# Altium schematic sheet Sheet1.SchDoc
size OrCAD C; SheetNumber: 1; SheetTotal: 1; SPICEModelCacheQUOSSJTI: <root> / <DocumentId>QUOSSJTI</DocumentId> / </root>
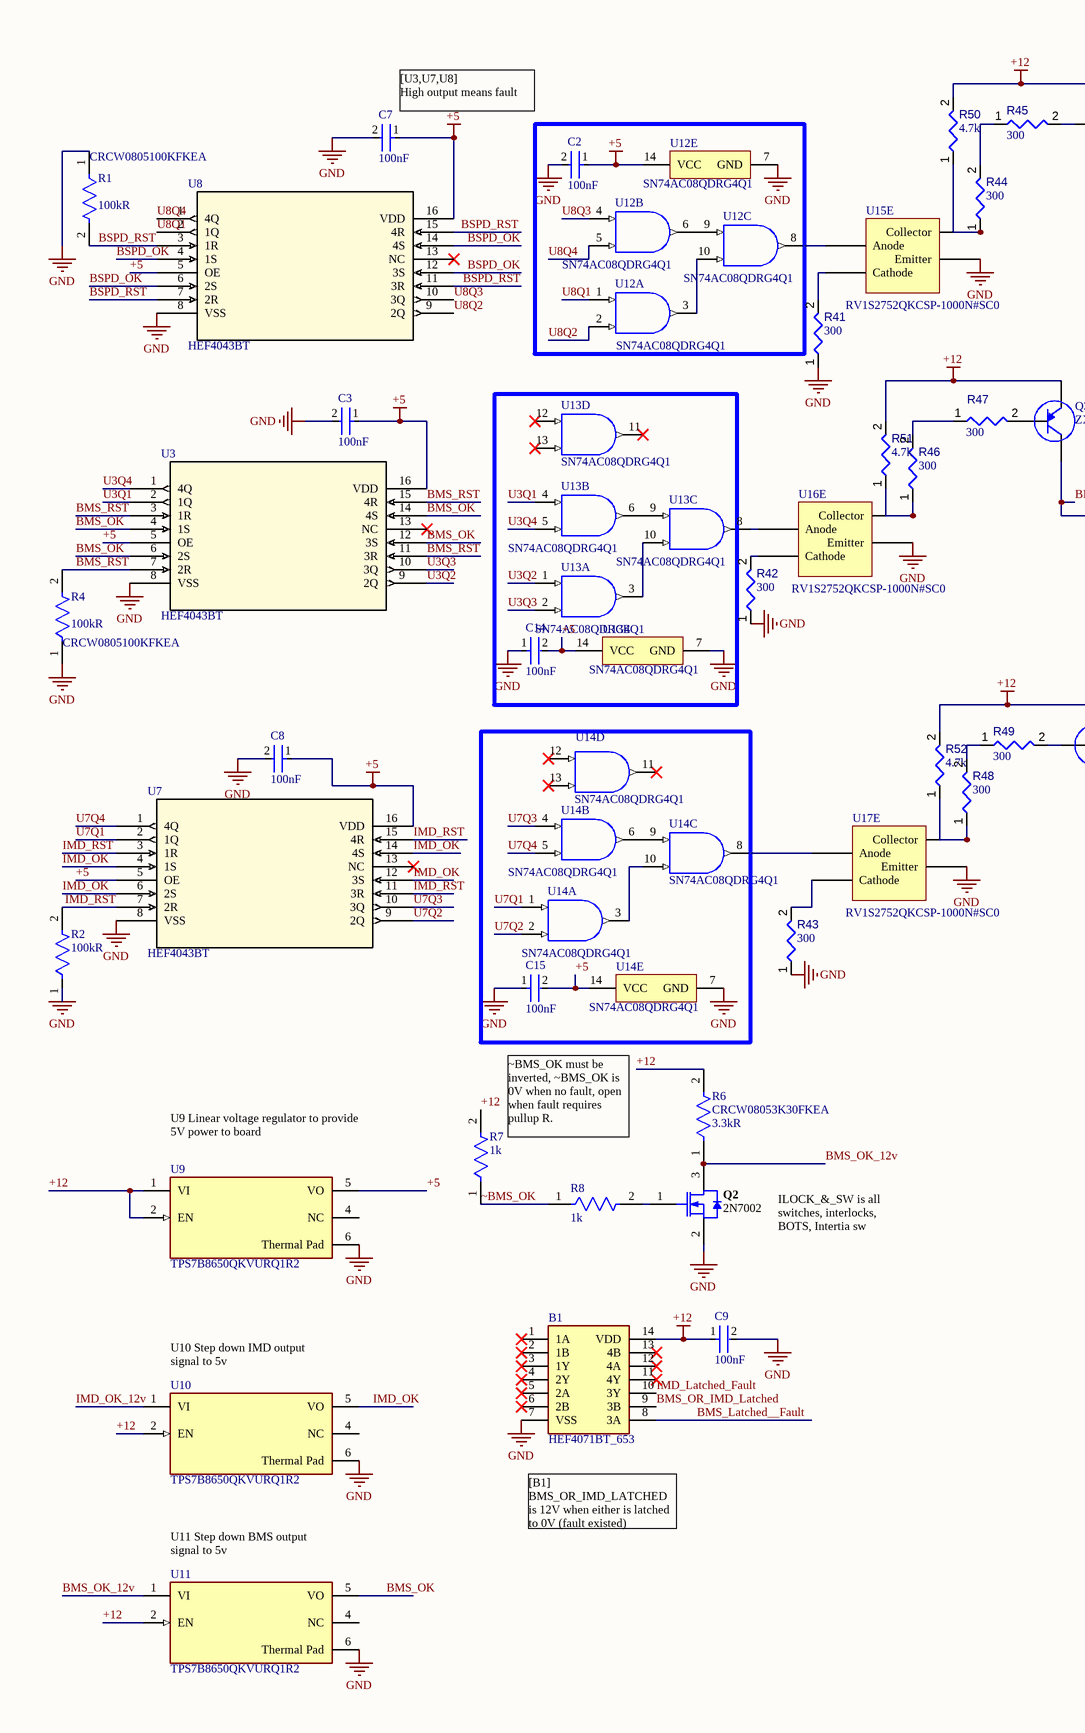
[diagram p0: Sheet1.SchDoc, left]
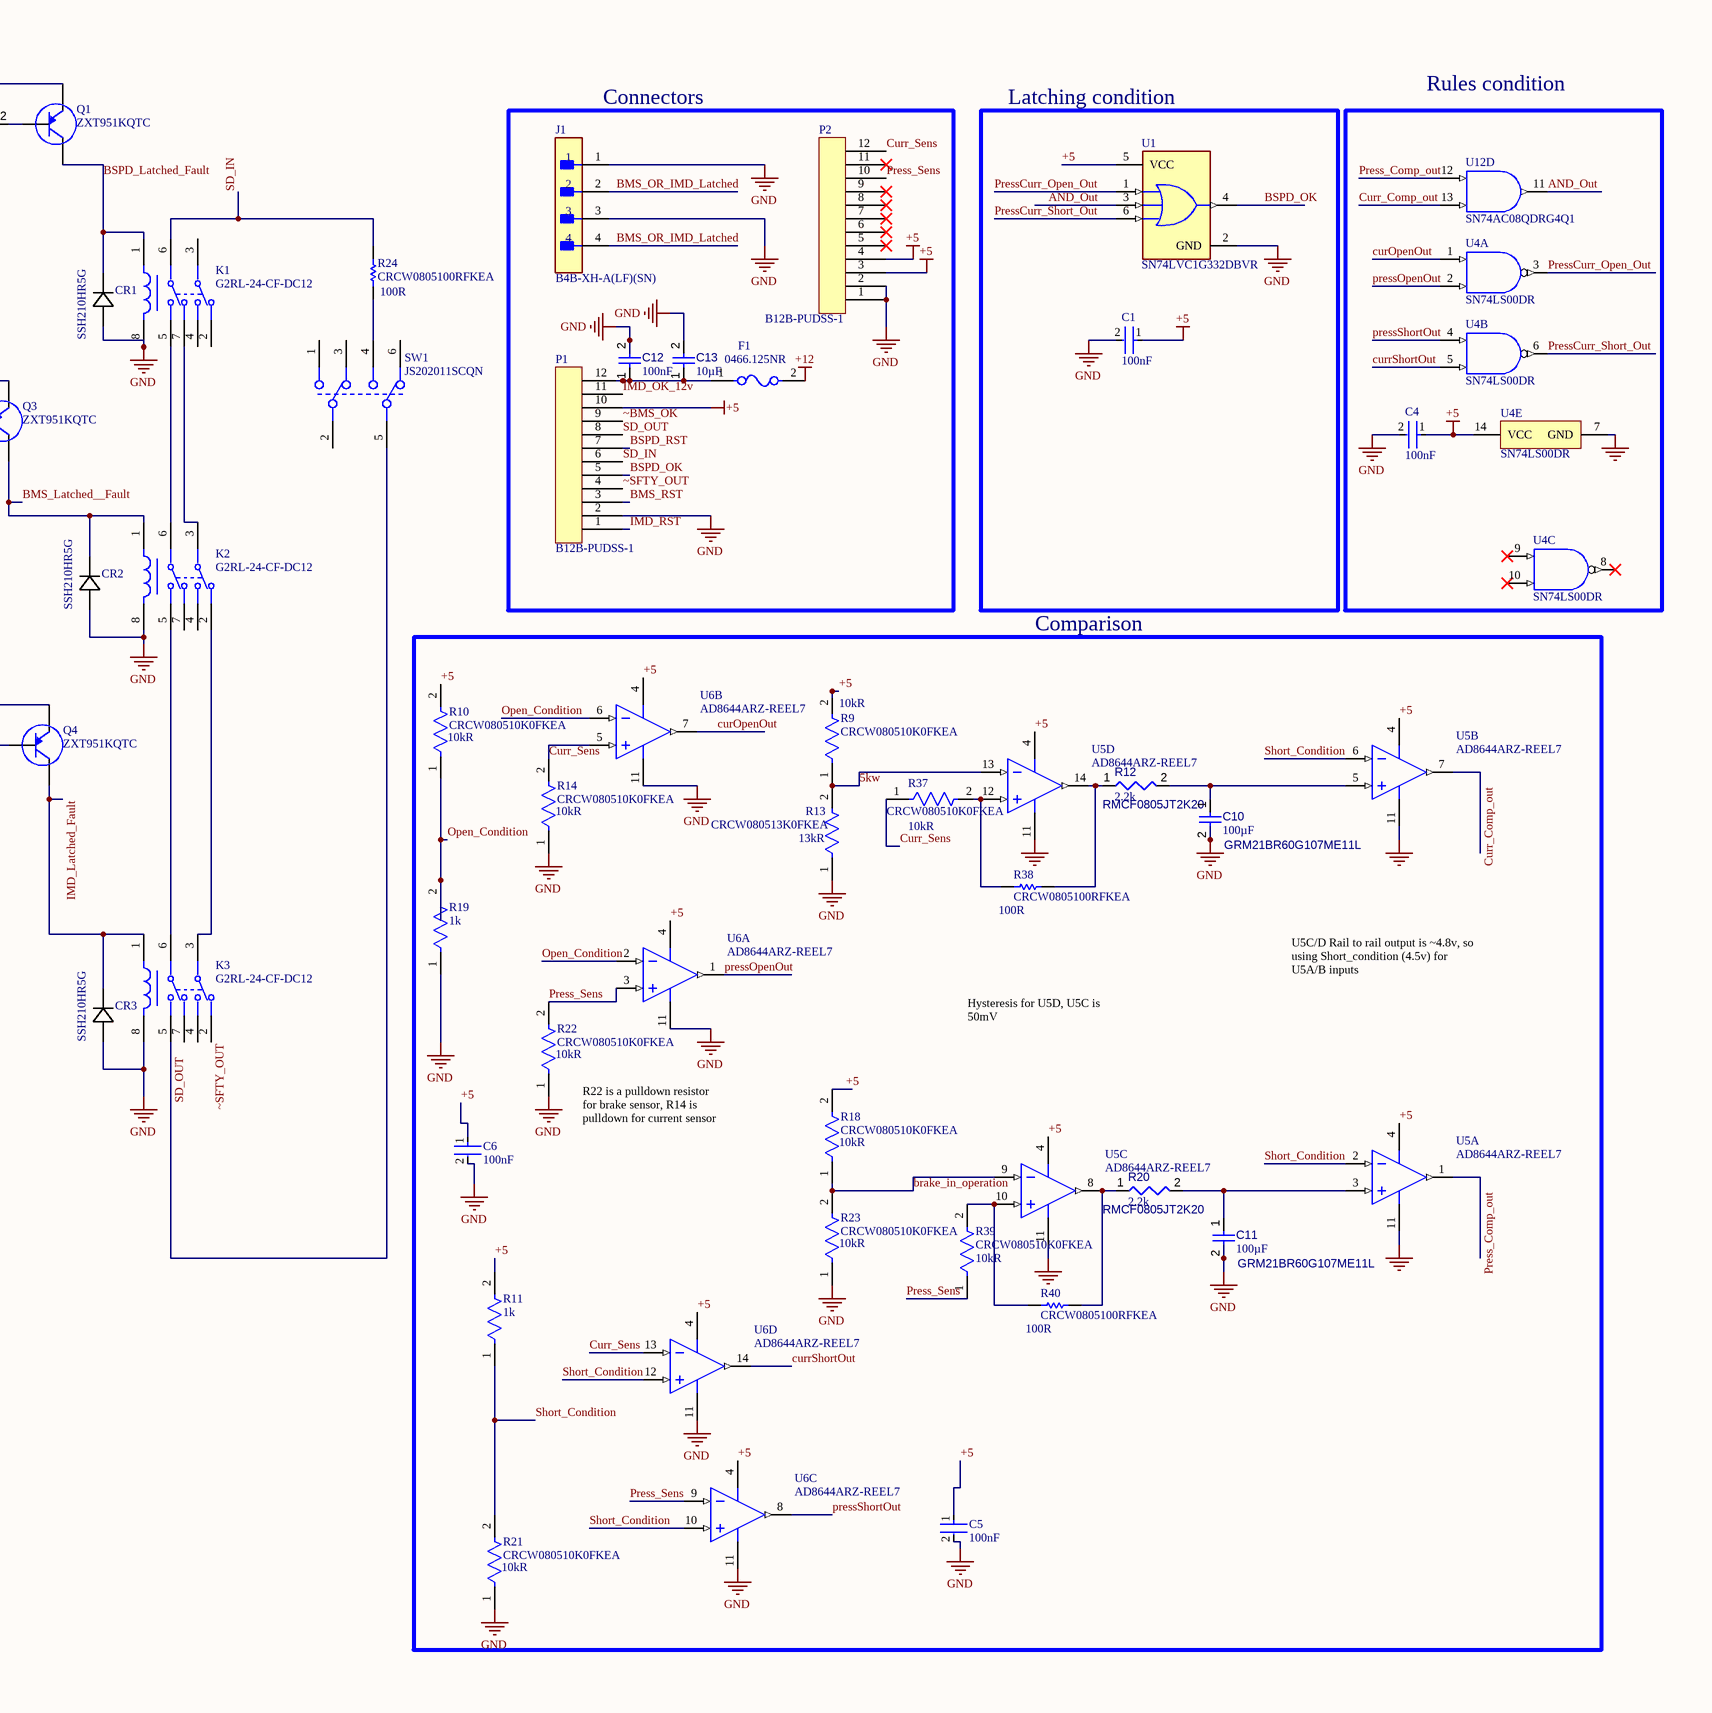
[diagram p1: Sheet1.SchDoc, right]

## Parts
B1  HEF4071BT_653  [SOIC127P600X175-14N]
C1  value 100nF  [FP-GCD21B-0_15-IPC_A]  (hidden comment: GCD21BR71H104KA01L)
C2  value 100nF  [FP-GCD21B-0_15-IPC_A]  (hidden comment: GCD21BR71H104KA01L)
C3  value 100nF  [FP-GCD21B-0_15-IPC_A]  (hidden comment: GCD21BR71H104KA01L)
C4  value 100nF  [FP-GCD21B-0_15-IPC_A]  (hidden comment: GCD21BR71H104KA01L)
C5  value 100nF  [FP-GCD21B-0_15-IPC_A]  (hidden comment: GCD21BR71H104KA01L)
C6  value 100nF  [FP-GCD21B-0_15-IPC_A]  (hidden comment: GCD21BR71H104KA01L)
C7  value 100nF  [FP-GCD21B-0_15-IPC_A]  (hidden comment: GCD21BR71H104KA01L)
C8  value 100nF  [FP-GCD21B-0_15-IPC_A]  (hidden comment: GCD21BR71H104KA01L)
C9  value 100nF  [FP-GCD21B-0_15-IPC_A]  (hidden comment: GCD21BR71H104KA01L)
C10  GRM21BR60G107ME11L  value 100µF  [CAPC0805(2012)145_L]
C11  GRM21BR60G107ME11L  value 100µF  [CAPC0805(2012)145_L]
C12  value 100nF  [CAPC2013X95X50LL10T25]  (hidden comment: Capacitor 100 nF +/-10% 50 V 0805)
C13  value 10µF  [CAPC2013X135X45NL10T25]  (hidden comment: Capacitor 10 uF +/- 10% 16 V 0805)
C14  value 100nF  [FP-GCD21B-0_15-IPC_A]  (hidden comment: GCD21BR71H104KA01L)
C15  value 100nF  [FP-GCD21B-0_15-IPC_A]  (hidden comment: GCD21BR71H104KA01L)
CR1  SSH210HR5G  [CR_DO214AA_TWS]
CR2  SSH210HR5G  [CR_DO214AA_TWS]
CR3  SSH210HR5G  [CR_DO214AA_TWS]
F1  0466.125NR  [FP-0466-MFG]
J1  B4B-XH-A(LF)(SN)  [FP-B4B-XH-A_LF_SN-MFG]
K1  G2RL-24-CF-DC12  [FP-G2RL-24-CF-DC24-MFG]
K2  G2RL-24-CF-DC12  [FP-G2RL-24-CF-DC24-MFG]
K3  G2RL-24-CF-DC12  [FP-G2RL-24-CF-DC24-MFG]
P1  B12B-PUDSS-1  [CONN_B12B-PUDSS_JST]
P2  B12B-PUDSS-1  [CONN_B12B-PUDSS_JST]
Q1  ZXT951KQTC  [DPAK228P990X239-4N]
Q2  2N7002  [INF-PG-SOT23_M]
Q3  ZXT951KQTC  [DPAK228P990X239-4N]
Q4  ZXT951KQTC  [DPAK228P990X239-4N]
R1  CRCW0805100KFKEA  Resistance: 100kR  [FP-CRCW0805-e3-MFG]
R2  Resistance: 100kR  [FP-CRCW0805-e3-MFG]  (hidden comment: CRCW0805100KFKEA)
R4  CRCW0805100KFKEA  Resistance: 100kR  [FP-CRCW0805-e3-MFG]
R6  CRCW08053K30FKEA  Resistance: 3.3kR  [FP-CRCW0805-e3-IPC_B]
R7  value 1k  [FP-CRCW0805-HPe3-IPC_B]  (hidden comment: CRCW08051K00JNEAHP)
R8  value 1k  [FP-CRCW0805-HPe3-IPC_B]  (hidden comment: CRCW08051K00JNEAHP)
R9  CRCW080510K0FKEA  Resistance: 10kR  [FP-CRCW0805-e3-IPC_A]
R10  CRCW080510K0FKEA  Resistance: 10kR  [FP-CRCW0805-e3-IPC_A]
R11  value 1k  [FP-CRCW0805-HPe3-IPC_B]  (hidden comment: CRCW08051K00JNEAHP)
R12  RMCF0805JT2K20  value 2.2k  [FP-RMCF0805-MFG]
R13  CRCW080513K0FKEA  Resistance: 13kR  [FP-CRCW0805-e3-IPC_C]
R14  CRCW080510K0FKEA  Resistance: 10kR  [FP-CRCW0805-e3-IPC_A]
R18  CRCW080510K0FKEA  Resistance: 10kR  [FP-CRCW0805-e3-IPC_A]
R19  value 1k  [FP-CRCW0805-HPe3-IPC_B]  (hidden comment: CRCW08051K00JNEAHP)
R20  RMCF0805JT2K20  value 2.2k  [FP-RMCF0805-MFG]
R21  CRCW080510K0FKEA  Resistance: 10kR  [FP-CRCW0805-e3-IPC_A]
R22  CRCW080510K0FKEA  Resistance: 10kR  [FP-CRCW0805-e3-IPC_A]
R23  CRCW080510K0FKEA  Resistance: 10kR  [FP-CRCW0805-e3-IPC_A]
R24  CRCW0805100RFKEA  resistance: 100R  [RESC2013X50X30LL20T20]
R37  CRCW080510K0FKEA  Resistance: 10kR  [FP-CRCW0805-e3-IPC_A]
R38  CRCW0805100RFKEA  resistance: 100R  [RESC2013X50X30LL20T20]
R39  CRCW080510K0FKEA  Resistance: 10kR  [FP-CRCW0805-e3-IPC_A]
R40  CRCW0805100RFKEA  resistance: 100R  [RESC2013X50X30LL20T20]
R41  value 300  [RESC2012X05N]  (hidden comment: CRCW0805300RJNEA)
R42  value 300  [RESC2012X05N]  (hidden comment: CRCW0805300RJNEA)
R43  value 300  [RESC2012X05N]  (hidden comment: CRCW0805300RJNEA)
R44  value 300  [RESC2012X05N]  (hidden comment: CRCW0805300RJNEA)
R45  value 300  [RESC2012X05N]  (hidden comment: CRCW0805300RJNEA)
R46  value 300  [RESC2012X05N]  (hidden comment: CRCW0805300RJNEA)
R47  value 300  [RESC2012X05N]  (hidden comment: CRCW0805300RJNEA)
R48  value 300  [RESC2012X05N]  (hidden comment: CRCW0805300RJNEA)
R49  value 300  [RESC2012X05N]  (hidden comment: CRCW0805300RJNEA)
R50  value 4.7k  [RESC2012X06N]  (hidden comment: RT0805FRE074K7L)
R51  value 4.7k  [RESC2012X06N]  (hidden comment: RT0805FRE074K7L)
R52  value 4.7k  [RESC2012X06N]  (hidden comment: RT0805FRE074K7L)
SW1  JS202011SCQN  [FP-JS202011SCQN-MFG]
U1  SN74LVC1G332DBVR  [FP-DBV0006A-MFG]
U3  HEF4043BT  [SOT109-1_NEX]
U4  SN74LS00DR  [D0014A_L]  (parts A,B,C,E of 5)
U5  AD8644ARZ-REEL7  [ADI-R-14_M]  (parts A,B,C,D of 4)
U6  AD8644ARZ-REEL7  [ADI-R-14_M]  (parts A,B,C,D of 4)
U7  HEF4043BT  [SOT109-1_NEX]
U8  HEF4043BT  [SOT109-1_NEX]
U9  TPS7B8650QKVURQ1R2  [FP-KVU0005A-MFG]
U10  TPS7B8650QKVURQ1R2  [FP-KVU0005A-MFG]
U11  TPS7B8650QKVURQ1R2  [FP-KVU0005A-MFG]
U12  SN74AC08QDRG4Q1  [D0014A_N]  (parts A,B,C,D,E of 5)
U13  SN74AC08QDRG4Q1  [D0014A_N]  (parts A,B,C,D,E of 5)
U14  SN74AC08QDRG4Q1  [D0014A_N]  (parts A,B,C,D,E of 5)
U15  RV1S2752QKCSP-1000N#SC0  [RV1S2752QKCSP-1000N#SC0]  (part E of 5)
U16  RV1S2752QKCSP-1000N#SC0  [RV1S2752QKCSP-1000N#SC0]  (part E of 5)
U17  RV1S2752QKCSP-1000N#SC0  [RV1S2752QKCSP-1000N#SC0]  (part E of 5)

## Blocks framed on the sheet
Connectors: C12 C13 F1 J1 P1 P2
Latching condition: C1 U1
Rules condition: C4 U4 U12
Comparison: C5 C6 C10 C11 R9-R14 R18-R23 R37-R40 U5 U6

## Nets
+5: C1.1 C2.1 C3.1 C4.1 C5.1 C6.1 C7.1 C8.1 C14.2 C15.2 P1.10 P2.3 P2.4 R9.2 R10.2 R11.2 R18.2 U1.5(VCC) U3.5(OE) U3.16(VDD) U4.14(VCC) U5.4(+V) U6.4(+V) U7.5(OE) U7.16(VDD) U8.5(OE) U8.16(VDD) U9.5(VO) U12.14(VCC) U13.14(VCC) U14.14(VCC)
+12: B1.14(VDD) C9.1 F1.2 Q1.3(E) Q3.3(E) Q4.3(E) R6.2 R7.2 R50.2 R51.2 R52.2 U9.1(VI) U9.2(EN) U10.2(EN) U11.2(EN)
GND: B1.7(VSS) C1.2 C2.2 C3.2 C4.2 C5.2 C6.2 C7.2 C8.2 C9.2 C10.2 C11.2 C12.2 C13.2 C14.1 C15.1 CR1.2 CR2.2 CR3.2 J1.1 J1.3 K1.8 K2.8 K3.8 P1.2 P2.1 P2.2 Q2.2(SOURCE) R1.1 R2.1 R4.1 R13.1 R14.1 R19.1 R21.1 R22.1 R23.1 R41.1 R42.1 R43.1 U1.2(GND) U3.8(VSS) U4.7(GND) U5.11(-V) U6.11(-V) U7.8(VSS) U8.8(VSS) U9.6(Thermal_Pad) U10.6(Thermal_Pad) U11.6(Thermal_Pad) U12.7(GND) U13.7(GND) U14.7(GND) U15.3(Emitter) U16.3(Emitter) U17.3(Emitter)
5kw: R9.1 R13.2 U5.13(-IN_D)
AND_Out: U1.3(B) U12.11(4Y)
BMS_Latched__Fault: B1.8(3A) CR2.1 K2.1 Q3.2(C)
BMS_OK: U3.4(1S) U3.6(2S) U3.12(3S) U3.14(4S) U11.5(VO)
BMS_OK_12v: Q2.3(DRAIN) R6.1 U11.1(VI)
BMS_OR_IMD_Latched: B1.9(3B) J1.2 J1.4
BMS_RST: P1.3 R4.2 U3.3(1R) U3.7(2R) U3.11(3R) U3.15(4R)
brake_in_operation: R18.1 R23.2 U5.9(-IN_C)
BSPD_Latched_Fault: CR1.1 K1.1 Q1.2(C)
BSPD_OK: P1.5 U1.4(Y) U8.4(1S) U8.6(2S) U8.12(3S) U8.14(4S)
BSPD_RST: P1.7 R1.2 U8.3(1R) U8.7(2R) U8.11(3R) U8.15(4R)
curOpenOut: U4.1(1A) U6.7(OUT_B)
Curr_Comp_out: U5.7(OUT_B) U12.13(4B)
Curr_Sens: P2.12 R14.2 R37.1 U6.5(+IN_B) U6.13(-IN_D)
currShortOut: U4.5(2B) U6.14(OUT_D)
IMD_Latched_Fault: B1.10(3Y) CR3.1 K3.1 Q4.2(C)
IMD_OK: U7.4(1S) U7.6(2S) U7.12(3S) U7.14(4S) U10.5(VO)
IMD_OK_12v: P1.11 U10.1(VI)
IMD_RST: P1.1 R2.2 U7.3(1R) U7.7(2R) U7.11(3R) U7.15(4R)
Open_Condition: R10.1 R19.2 U6.2(-IN_A) U6.6(-IN_B)
Press_Comp_out: U5.1(OUT_A) U12.12(4A)
Press_Sens: P2.10 R22.2 R39.1 U6.3(+IN_A) U6.9(-IN_C)
PressCurr_Open_Out: U1.1(A) U4.3(1Y)
PressCurr_Short_Out: U1.6(C) U4.6(2Y)
pressOpenOut: U4.2(1B) U6.1(OUT_A)
pressShortOut: U4.4(2A) U6.8(OUT_C)
SD_IN: K1.6 P1.6 R24.2
SD_OUT: K3.5 P1.8 SW1.5
Short_Condition: R11.1 R21.2 U5.2(-IN_A) U5.6(-IN_B) U6.10(+IN_C) U6.12(+IN_D)
U3Q1: U3.2(1Q) U13.4(2A)
U3Q2: U3.9(2Q) U13.1(1A)
U3Q3: U3.10(3Q) U13.2(1B)
U3Q4: U3.1(4Q) U13.5(2B)
U7Q1: U7.2(1Q) U14.1(1A)
U7Q2: U7.9(2Q) U14.2(1B)
U7Q3: U7.10(3Q) U14.4(2A)
U7Q4: U7.1(4Q) U14.5(2B)
U8Q1: U8.2(1Q) U12.1(1A)
U8Q2: U8.9(2Q) U12.2(1B)
U8Q3: U8.10(3Q) U12.4(2A)
U8Q4: U8.1(4Q) U12.5(2B)
~BMS_OK: P1.9 R7.1 R8.1
~SFTY_OUT: K3.2 P1.4
NetC10_1: C10.1 R12.2 U5.5(+IN_B)
NetC11_1: C11.1 R20.2 U5.3(+IN_A)
NetC12_1: C12.1 C13.1 F1.1 P1.12
NetK1_5: K1.5 K2.6
NetK1_7: K1.7 K2.3
NetK2_2: K2.2 K3.3
NetK2_5: K2.5 K3.6
NetQ1_1: Q1.1(B) R45.2
NetQ2_1: Q2.1(GATE) R8.2
NetQ3_1: Q3.1(B) R47.2
NetQ4_1: Q4.1(B) R49.2
NetR12_1: R12.1 R38.2 U5.14(OUT_D)
NetR20_1: R20.1 R40.2 U5.8(OUT_C)
NetR24_1: R24.1 SW1.4
NetR37_2: R37.2 R38.1 U5.12(+IN_D)
NetR39_2: R39.2 R40.1 U5.10(+IN_C)
NetR41_2: R41.2 U15.2(Cathode)
NetR42_2: R42.2 U16.2(Cathode)
NetR43_2: R43.2 U17.2(Cathode)
NetR44_1: R44.1 R50.1 U15.4(Collector)
NetR44_2: R44.2 R45.1
NetR46_1: R46.1 R51.1 U16.4(Collector)
NetR46_2: R46.2 R47.1
NetR48_1: R48.1 R52.1 U17.4(Collector)
NetR48_2: R48.2 R49.1
NetU12_3: U12.3(1Y) U12.10(3B)
NetU12_6: U12.6(2Y) U12.9(3A)
NetU12_8: U12.8(3Y) U15.1(Anode)
NetU13_3: U13.3(1Y) U13.10(3B)
NetU13_6: U13.6(2Y) U13.9(3A)
NetU13_8: U13.8(3Y) U16.1(Anode)
NetU14_3: U14.3(1Y) U14.10(3B)
NetU14_6: U14.6(2Y) U14.9(3A)
NetU14_8: U14.8(3Y) U17.1(Anode)

Not connected (* = marked no-connect by the designer): B1 1(1A)* 2(1B)* 3(1Y)* 4(2Y)* 5(2A)* 6(2B)* 11(4Y)* 12(4A)* 13(4B)*; K1 2 3 4; K2 4 7; K3 4 7; P2 5* 6* 7* 8* 9* 11*; SW1 1 2 3 6; U3 13(NC)*; U4 8(3Y)* 9(3A)* 10(3B)*; U7 13(NC)*; U8 13(NC)*; U9 4(NC); U10 4(NC); U11 4(NC); U13 11(4Y)* 12(4A)* 13(4B)*; U14 11(4Y)* 12(4A)* 13(4B)*

## Notes on the sheet
- (near C7) [U3,U7,U8]
  High output means fault
- Hysteresis for U5D, U5C is 50mV
- U5C/D Rail to rail output is ~4.8v, so using Short_condition (4.5v) for U5A/B inputs
- (near R7) ~BMS_OK must be inverted, ~BMS_OK is 0V when no fault, open when fault requires pullup R.
- (near R22) R22 is a pulldown resistor for brake sensor, R14 is pulldown for current sensor
- (near U9) U9 Linear voltage regulator to provide 5V power to board
- ILOCK_&_SW is all switches, interlocks, BOTS, Intertia sw
- (near U10) U10 Step down IMD output signal to 5v
- [B1] BMS_OR_IMD_LATCHED is 12V when either is latched to 0V (fault existed)
- (near U11) U11 Step down BMS output signal to 5v

## Library data of the parts
B1 = CMP-134-000000-1: HEF4071B - Quad 2-input OR gate@en-us; Manufacturer_Part_Number: HEF4071BT,653; Manufacturer_Name: Nexperia; Geometry.Height: 1.75mm; Mouser Part Number: 771-HEF4071BTD-T; Datasheet Link: https://assets.nexperia.com/documents/data-sheet/HEF4071B.pdf; Mouser Price/Stock: https://www.mouser.co.uk/ProductDetail/Nexperia/HEF4071BT653?qs=me8TqzrmIYXNRWvrSyNJIw%3D%3D; Source: HEF4071BT_653.SchLib; Design Item ID: HEF4071BT_653
C1-C9 C14 C15 = CMP-001-00087-1: Ceramic Capacitor, Multilayer, Ceramic, 50V, 10% +Tol, 10% -Tol, X7R, 15% TC, 0.1uF, Surface Mount, 0805; Case/Package: 0805; Mounting Technology: Surface Mount; Min Operating Temperature: -55°C; Capacitor Type: Ceramic; Pins: 2; RoHS Compliant: Yes; Max Operating Temperature: 125°C
C10 C11 = CMP-001-00054-4: Chip Capacitor, 100µF +/-20%, 6.3V, 0805, Thickness 1.45 mm; Tolerance: 10%; Min Operating Temperature: -55°C; Max Operating Temperature: 85°C; Pins: 2; Mounting Technology: SMT; Case/Package: 0805; Voltage Rating: 6.3V
C12 = CMP-001-00018-6: Chip Capacitor, 100 nF, +/- 10%, 50 V, 0805 (2012 Metric); Capacitor Type: Ceramic; Voltage Rating: 50V; Pins: 2; Max Operating Temperature: 125°C; Min Operating Temperature: -55°C; Mounting Technology: SM; Case/Package: 0805; RoHS Compliant: True; Tolerance: 10%
C13 = CMP-001-00015-6: Chip Capacitor, 10 uF, +/- 10%, 16 V, 0805 (2012 Metric); Voltage Rating: 16V; Capacitor Type: Ceramic; RoHS Compliant: True; Max Operating Temperature: 85°C; Min Operating Temperature: -55°C; Mounting Technology: SM; Tolerance: 10%; Case/Package: 0805; Pins: 2
CR1-CR3 = CMP-171-000003-1: No Description Available; Mfr_Name: Taiwan Semiconductor; Design Item ID: SSH210HR5G; Source: SSH210HR5G.SchLib
F1 = CMP-08605-000030-1: FUSE BOARD MNT 125MA 125VAC/VDC; Manufacturer: Littelfuse Inc; Fuse Current: 0.125A; Value: 3.925Ω; Max Fuse Ac Voltage: 125V; Fuse Interrupt Dc Current: 50A; Fuse Voltage Drop: 634.37mV; Fuse I2T: 0.00064A2Sec; Fuse Blow Speed: Fast; Octopart: https://octopart.com/0466.125nr-littelfuse-566000; Temperature: -55°C to +90°C; ComponentLink2URL: https://www.littelfuse.com/~/media/electronics/datasheets/fuses/littelfuse_fuse_466_datasheet.pdf.pdf; Category: Fuse; Temperature Range High: +90°C; Resistance: 3.925Ω; ComponentLink2Description: Datasheet; Package: 0466; Height: 0.66mm; Mouser Description: Surface Mount Fuses 125V .125A VFA Slimline; Automotive: No; RoHS: TRUE; Device Class L2: Fuses; Voltage Rating: 125V; Lead Free: Yes; Manufacturer Part Number: 0466.125NR; Temperature Range Low: -55°C; Device Class L3: unset; Device Class L1: Circuit Protection; Max Fuse Dc Voltage: 125V; Fuse Interrupt Ac Current: 50A; Digikey Description: FUSE BOARD MNT 125MA 125VAC/VDC
J1 = CMP-17439-000250-1: CONN HEADER VERT 4POS 2.5MM; Number of Contacts: 4; Contact Resistance: 20mR; Voltage Rating: 250V; Max Current Rating: 3A; Gender: Male; Wire/Cable Gauge: 22AWG; Mated Stacking Heights: 9.8mm; Insulation Resistance: 1GR; Orientation: Straight; Contact Type: Male Pin; Contact Finish - Mating: TIN; Series: XH; Max Voltage Rating (AC): 250V; Lead Pitch: 2.5mm; Contact Shape: Square; Insulation Color: Natural; Termination: Solder; Lead Free: Lead Free; Voltage Rating (AC): 250V; Number of Rows: 1; Flammability Rating: UL94 V-0; Number of Positions: 4; Max Operating Temperature: 85°C; Package Quantity: 500; Mount: Through Hole; REACH SVHC: No SVHC; Connector Type: Header; Insulation Material: Nylon; Fastening Type: Detent; Min Operating Temperature: -25°C; Housing Color: White; Packaging: Bulk; Contact Plating: Tin; Contact Material: Brass; Max Voltage Rating (DC): 250V; Housing Material: Polyamide; Color: Natural; Material: Polyamide; Pitch: 2.5mm; Depth: 5.75mm; Current Rating: 3A; Length: 12.4mm
K1-K3 = CMP-008-00006-1: Power Relay 12VDC 8A DPDT (( 29mm 12.7mm 15.7mm)) Through Hole
P1 P2 = B12B-PUDSS-1: Connector Header Through Hole 12 position 0.079" (2.00mm); Supplier 1: Digi-Key; Supplier Part Number 1: 455-B12B-PUDSS-1-ND
Q1 Q3 Q4 = CMP-013-00041-1: Power Bipolar Transistor, 6A I(C), 60V V(BR)CEO, 1-Element, PNP, Silicon, TO-252, Plastic/Epoxy, 2 Pin; RoHS Compliant: Yes
Q2 = CMP-1149-00026-1: N-Channel OptiMOS Small-Signal-Transistor, 60 V VDS, 0.3 A ID, -55 to 150 degC, PG-SOT23, Reel, Green; Manufacturer: Infineon; RDS (on) (max) (@4.5V): 4,000 mOhm; VDS (max): 60 V; IDpuls (max): 1.2Â A; QG: 0.4Â nC; RDS (on) (max): 3,000 mOhm; RthJA (max): 250 K/W; ID (max): 0.3Â A; VGS(th) (max): 2.5Â V; VGS(th) (min): 1.5Â V; Green: TRUE; Ptot (max): 0.5Â W; PackageDescription: 3-Pin Small Outline Transistor Package, 2.9 x 1.3 mm Body, 0.95 mm Pitch; Halogen-free: TRUE; ComponentLink2Description: Datasheet; ComponentLink1URL: http://www.infineon.com/; Packing: Reel; DatasheetVersion: Rev. 2.4; PartNumber: 2N7002; PackageReference: PG-SOT23; PackageVersion: Apr-08; ComponentLink3URL: http://www.infineon.com/dgdl/SOT23-Package_Overview.pdf?folderId=db3a30431936bc4b0119532290053c66&fileId=db3a30431936bc4b0119533468123c85; ComponentLink1Description: Manufacturer URL; Mounting Technology: Surface Mount; ComponentLink3Description: Package Specification; ComponentLink2URL: http://www.infineon.com/dgdl/2N7002_Rev2.4.pdf?folderId=db3a3043156fd573011622e10b5c1f67&fileId=db3a304319bc939a0119c2a9461e79e6
R1 R2 R4 = CMP-2001-04899-2: RES Thick Film, 100kΩ, 1%, 0.125W, 100ppm/°C, 0805; Power Rating: 125mW; Voltage Rating: 150V; Case/Package: 0805; Max Operating Temperature: 155°C; Case Code (Imperial): 0805; Lead Free: Lead Free; Weight: 0.000194oz; Number of Pins: 2; Package Quantity: 5000; Height: 0.45mm; Composition: Thick Film; Military Standard: Not; Tolerance: 1%; Case Code (Metric): 2012; Termination: SMD/SMT; Mount: Surface Mount; Radiation Hardening: No; Width: 1.25mm; Length: 2mm; Depth: 1.25mm; Packaging: Tape and Reel; Min Operating Temperature: -55°C; Contact Plating: Tin; Temperature Coefficient: 100ppm/°C; Voltage Rating (DC): 150V
R6 = CMP-2001-03876-2: RES Thick Film, 3.3kΩ, 1%, 0.125W, 100ppm/°C, 0805; Max Power Dissipation: 125mW; Voltage Rating: 150V; Package Quantity: 10; Height: 0.45mm; Case/Package: 0805; Length: 2mm; Mount: Surface Mount; Packaging: Tape and Reel; Features: Automotive AEC-Q200; Termination: SMD/SMT; Radiation Hardening: No; Case Code (Imperial): 0805; Weight: 0.000194oz; Min Operating Temperature: -55°C; Max Operating Temperature: 155°C; Composition: Thick Film; Case Code (Metric): 2012; Voltage Rating (DC): 150V; Lead Free: Lead Free; Temperature Coefficient: 100ppm/°C; Depth: 1.25mm; Number of Terminations: 2; Military Standard: Not; Contact Plating: Tin; Tolerance: 1%; Power Rating: 125mW; Width: 1.25mm
R7 R8 R11 R19 = CMP-009-00200-1: Fixed Resistor, Metal Glaze/thick Film, 0.5W, 1000ohm, 150V, 5% +/-Tol, 200ppm/Cel, Surface Mount, 0805; Power: 500mW; Pins: 2; Max Operating Temperature: 155°C; Mounting Technology: Surface Mount; Case/Package: 0805; RoHS Compliant: Yes; Min Operating Temperature: -55°C; Tolerance: 5%
R9 R10 R14 R18 R21-R23 R37 R39 = CMP-2001-04908-2: RES Thick Film, 10kΩ, 1%, 0.125W, 100ppm/°C, 0805; Voltage Rating (DC): 150V; Power Rating: 125mW; Weight: 0.000194oz; Package Quantity: 5000; Military Standard: Not; Max Operating Temperature: 155°C; Temperature Coefficient: 100ppm/°C; Contact Plating: Tin; Width: 1.25mm; Height: 0.45mm; Radiation Hardening: No; Tolerance: 1%; Min Operating Temperature: -55°C; Voltage Rating: 150V; Length: 2mm; Depth: 1.25mm; Termination: SMD/SMT; Packaging: Tape and Reel; Case/Package: 0805; Case Code (Metric): 2012; Lead Free: Lead Free; Case Code (Imperial): 0805; Composition: Thick Film
R12 R20 = CMP-009-00199-1: Fixed Resistor, Metal Glaze/thick Film, 0.125W, 2200ohm, 150V, 5% +/-Tol, 200ppm/Cel, Surface Mount, 0805; Power: 125mW; Max Operating Temperature: 155°C; Case/Package: 0805; Min Operating Temperature: -55°C; Pins: 2; RoHS Compliant: Yes; Tolerance: 5%; Mounting Technology: Surface Mount
R13 = CMP-2001-04945-2: RES Thick Film, 13kΩ, 1%, 0.125W, 100ppm/°C, 0805; Voltage Rating: 150V; Power Rating: 125mW; Case/Package: 0805; Tolerance: 1%; Depth: 1.25mm; Features: Automotive AEC-Q200; Termination: SMD/SMT; Lead Free: Lead Free; Min Operating Temperature: -55°C; Package Quantity: 10; Voltage Rating (DC): 150V; Composition: Thick Film; Case Code (Metric): 2012; Contact Plating: Tin; Weight: 0.000194oz; Max Operating Temperature: 155°C; Case Code (Imperial): 0805; Military Standard: Not; Number of Terminations: 2; Width: 1.25mm; Number of Pins: 2; Mount: Surface Mount; Radiation Hardening: No; Temperature Coefficient: 100ppm/°C; Packaging: Tape and Reel; Max Power Dissipation: 125mW; Length: 2mm; Height: 0.45mm
R24 R38 R40 = CMP-2001-04901-1: Manufacturer: Vishay Dale; Part Number: CRCW0805100RFKEA
R41-R49 = CMP-009-00194-2: Fixed Resistor, Metal Glaze/thick Film, 0.125W, 300ohm, 150V, 5% +/-Tol, 200ppm/Cel, Surface Mount, 0805; Power: 125mW; Min Operating Temperature: -55°C; Pins: 2; Case/Package: 0805; RoHS Compliant: Yes; Mounting Technology: Surface Mount; Tolerance: 5%; Max Operating Temperature: 155°C
R50-R52 = CMP-009-00195-2: Fixed Resistor, Thin Film, 0.125W, 4700ohm, 150V, 1% +/-Tol, 50ppm/Cel, Surface Mount, 0805; Power: 125mW; Mounting Technology: Surface Mount; Pins: 2; Max Operating Temperature: 155°C; RoHS Compliant: Yes; Tolerance: 1%; Min Operating Temperature: -55°C; Case/Package: 0805
SW1 = CMP-2000-05087-3: SWITCH SLIDE DPDT 300MA 6V; Switch Function: On-On; Actuator Type: Standard; Switch Travel: 2mm; Actuator Color: Black; Contact Resistance: 70mR; Electrical Life: 5000Cycles; Actuator Material: Nylon; REACH SVHC: No SVHC; Series: JS; Min Operating Temperature: -20°C; Depth: 7.5mm; Housing Material: Nylon; Voltage Rating (DC): 6V; Max Operating Temperature: 85°C; Contact Current Rating: 300mA; Package Quantity: 1; Contact Plating: Silver; Contact Material: Copper Alloy; Throw Configuration: DPDT; Current Rating: 300mA; Orientation: Vertical; Max Current Rating: 300mA; Max Voltage Rating (DC): 6V; Flammability Rating: UL94 V-2; Length: 9mm; Packaging: Tape and Reel; Mount: Surface Mount; Actuator Length: 2mm; Lead Free: Lead Free; Termination: Gull Wing; Radiation Hardening: No
U1 = CMP-0859-00188-4: IC GATE OR 1CH 3-INP SOT23-6; Manufacturer: TEXAS INSTRUMENTS; Number Of Inputs: 3; Nominal Supply Current: 10-500uA; Number Of Circuits: 1; Max Supply Voltage: 5.5V; Standoff Height: 0mm; Propagation Delay: 4.5ns; Min Supply Voltage: 1.5V; Height: 1.45mm; Temperature Range High: +125°C; Device Class L3: Logic Gates; Device Class L2: Logic ICs; Lead Free: Yes; Temperature Range Low: -40°C; ComponentLink2URL: http://www.ti.com/lit/ds/symlink/sn74lvc1g332.pdf; Package: DBV0006A; ComponentLink2Description: Datasheet; Octopart: https://octopart.com/sn74lvc1g332dbvr-texas+instruments-464996; Category: IC; Automotive: No; Manufacturer Part Number: SN74LVC1G332DBVR; Ipc Land Pattern Name: SOT95P280X145-6; Logic Function Desc: OR; Ambient Temperature Range Low: -40°C; Temperature: -40°C to +125°C; Number Of Outputs: 1; Mouser Description: Logic Gates Sngl 3 Inpt + OR Gt; RoHS: TRUE; Ambient Temperature Range High: +125°C; Device Class L1: Integrated Circuits (ICs); Digikey Description: IC GATE OR 1CH 3-INP SOT23-6
U3 U7 U8 = HEF4043BT: No Description Available; Mfr_Name: Nexperia; RefDes: RefDes; Type: Type; Supplier 1: Digikey; Supplier Part Number 1: 1727-HEF4043BT-Q100JCT-ND
U4 = CMP-016-00012-1: 4-ch, 2-input, 4.75-V to 5.25-V bipolar NAND gates 14-SOIC 0 to 70
U5 U6 = CMP-0384-00477-1: Quad Channel Single-Supply Operation Operational Amplifier, 5.5 MHz BW, 7.5 V/us SR, Industrial, 14-pin SOIC (R-14), Reel; Manufacturer: Analog Devices; Generic Part Number: AD8644; V Span Min: 5V; Iq/Amp: 1.1mA; Amplifiers Per Package: 4; V Span Max: 18V; Input Offset Voltage: 1mV; Input Bias Current: 80nA; Small Signal Bandwidth: 5.5MHz; DatasheetVersion: Rev. B; ComponentLink1Description: Manufacturer URL; ComponentLink3URL: http://www.analog.com/static/imported-files/packages/PKG_PDF/SOIC_Narrow%20(R)/R_14.pdf; ComponentLink3Description: Package Specification; Mounting Technology: Surface Mount; Code_JEDEC: MS-012-AB; PackageReference: R-14; PartNumber: AD8644ARZ-REEL7; ComponentLink2Description: Datasheet; PackageVersion: 060606-A; ComponentLink1URL: http://www.analog.com/en/index.html; PackageDescription: 14-Pin Standard Small Outline Package, Body 8.65 x 3.9 mm, Pitch 1.27 mm; Slew Rate: 7.5V/us; ComponentLink2URL: http://www.analog.com/static/imported-files/data_sheets/AD8614_8644.pdf
U9-U11 = CMP-04917-000307-1: AUTOMOTIVE 500-MA, 40-V, ULTRA-L
U12-U14 = CMP-0777-00056-3: Automotive Catalog Quadruple 2-Input Positive-AND Gates, D0014A, LARGE T&R; Manufacturer: Texas Instruments; Generic Part Number: SN74AC08-Q1; VCC(Max)(V): 6; Voltage(Nom)(V): 3.3,5; Schmitt Trigger: No; Output Type: CMOS; VCC(Min)(V): 2; Technology Family: AC; F @ Nom Voltage(Max)(Mhz): 100; Bits(#): 4; tpd @ Nom Voltage(Max)(ns): 10,8.5; Output Drive (IOL/IOH)(Max)(mA): -24/24; ICC @ Nom Voltage(Max)(mA): 0.02; DatasheetVersion: SCAS789A; PackageReference: D0014A; Rating: Automotive; Input Type: CMOS; Operating Temperature Range(C): -40 to 125
U15-U17 = RV1S2752QKCSP-1000N#SC0: Optoisolator Transistor Output 3750Vrms 1 Channel; Supplier 1: Mouser; Supplier Part Number 1: 968-752QKCSP1000NSC0